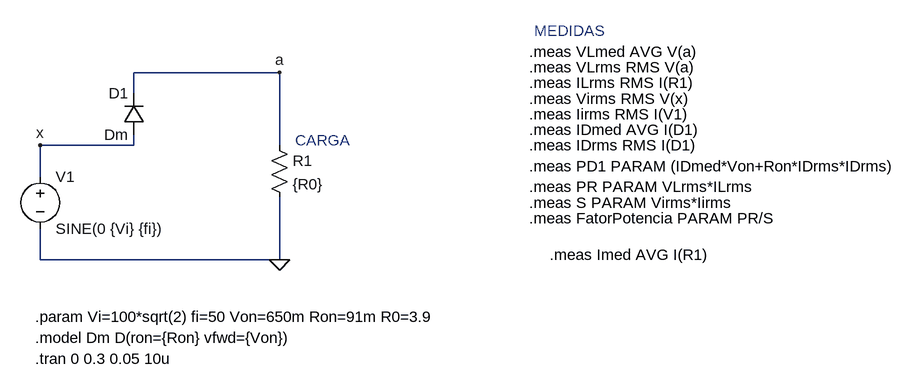
[diagram p0: schematic Q02-QUESTAO1.asc]
Q02-QUESTAO1.asc, the LTspice schematic file:
Version 4.1
SHEET 1 1416 680
WIRE 416 -32 192 -32
WIRE 192 0 192 -32
WIRE 192 80 192 64
WIRE 192 80 48 80
WIRE 416 80 416 -32
WIRE 48 128 48 80
WIRE 48 256 48 208
WIRE 416 256 416 160
WIRE 416 256 48 256
FLAG 416 256 0
FLAG 48 80 x
FLAG 416 -32 a
SYMBOL voltage 48 112 R0
WINDOW 123 0 0 Left 0
WINDOW 39 0 0 Left 0
SYMATTR InstName V1
SYMATTR Value SINE(0 {Vi} {fi})
SYMBOL diode 208 64 R180
WINDOW 0 24 64 Left 2
WINDOW 3 24 0 Left 2
SYMATTR InstName D1
SYMATTR Value Dm
SYMBOL res 400 64 R0
SYMATTR InstName R1
SYMATTR Value {R0}
TEXT 40 344 Left 2 !.param Vi=100*sqrt(2) fi=50 Von=650m Ron=91m R0=3.9
TEXT 40 376 Left 2 !.model Dm D(ron={Ron} vfwd={Von})
TEXT 40 408 Left 2 !.tran 0 0.3 0.05 10u
TEXT 808 -96 Left 2 ;MEDIDAS
TEXT 800 -64 Left 2 !.meas VLmed AVG V(a)
TEXT 800 -40 Left 2 !.meas VLrms RMS V(a)
TEXT 800 -16 Left 2 !.meas ILrms RMS I(R1)
TEXT 800 56 Left 2 !.meas IDmed AVG I(D1)
TEXT 800 80 Left 2 !.meas IDrms RMS I(D1)
TEXT 800 8 Left 2 !.meas Virms RMS V(x)
TEXT 800 32 Left 2 !.meas Iirms RMS I(V1)
TEXT 800 112 Left 2 !.meas PD1 PARAM (IDmed*Von+Ron*IDrms*IDrms)
TEXT 800 144 Left 2 !.meas PR PARAM VLrms*ILrms
TEXT 800 168 Left 2 !.meas S PARAM Virms*Iirms
TEXT 800 192 Left 2 !.meas FatorPotencia PARAM PR/S
TEXT 440 72 Left 2 ;CARGA
TEXT 832 248 Left 2 !.meas Imed AVG I(R1)

The netlist it stands for:
* Q02-QUESTAO1.asc
V1 x 0 SINE(0 {Vi} {fi})
D1 x a Dm
R1 a 0 {R0}
.model D D
.lib standard.dio
.param Vi=100*sqrt(2) fi=50 Von=650m Ron=91m R0=3.9
.model Dm D(ron={Ron} vfwd={Von})
.tran 0 0.3 0.05 10u
* MEDIDAS
.meas VLmed AVG V(a)
.meas VLrms RMS V(a)
.meas ILrms RMS I(R1)
.meas IDmed AVG I(D1)
.meas IDrms RMS I(D1)
.meas Virms RMS V(x)
.meas Iirms RMS I(V1)
.meas PD1 PARAM (IDmed*Von+Ron*IDrms*IDrms)
.meas PR PARAM VLrms*ILrms
.meas S PARAM Virms*Iirms
.meas FatorPotencia PARAM PR/S
* CARGA
.meas Imed AVG I(R1)
.backanno
.end